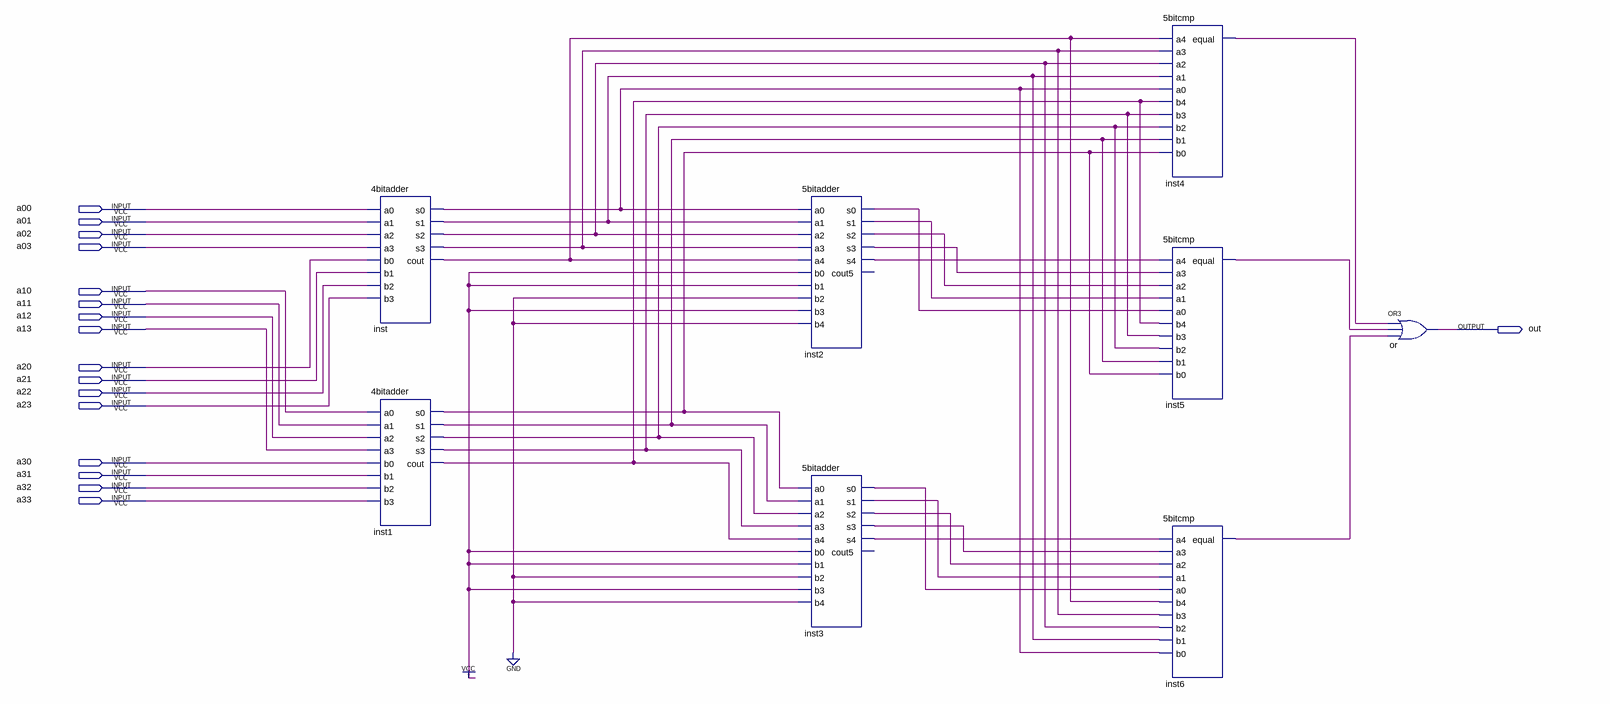
[diagram p0: schematic sheet]
// Quartus schematic multiple11.bdf as structural Verilog: 8 symbols, 17 pins
module multiple11 (
  input  a00,
  input  a01,
  input  a02,
  input  a03,
  input  a10,
  input  a11,
  input  a12,
  input  a13,
  input  a20,
  input  a21,
  input  a22,
  input  a23,
  input  a30,
  input  a31,
  input  a32,
  input  a33,
  output out
);

  wire inst1_cout, inst1_s0, inst1_s1, inst1_s2, inst1_s3, inst2_s0, inst2_s1, inst2_s2, inst2_s3, inst2_s4,
       inst3_s0, inst3_s1, inst3_s2, inst3_s3, inst3_s4, inst4_equal, inst5_equal, inst6_equal, inst_cout,
       inst_s0, inst_s1, inst_s2, inst_s3;

  \4bitadder  inst (
    .a0(a00), .a1(a01), .a2(a02), .a3(a03), .b0(a20), .b1(a21), .b2(a22), .b3(a23), .s0(inst_s0),
    .s1(inst_s1), .s2(inst_s2), .s3(inst_s3), .cout(inst_cout));
  \4bitadder  inst1 (
    .a0(a10), .a1(a11), .a2(a12), .a3(a13), .b0(a30), .b1(a31), .b2(a32), .b3(a33), .s0(inst1_s0),
    .s1(inst1_s1), .s2(inst1_s2), .s3(inst1_s3), .cout(inst1_cout));
  \5bitadder  inst2 (
    .a0(inst_s0), .a1(inst_s1), .a2(inst_s2), .a3(inst_s3), .a4(inst_cout), .b0(1'b1), .b1(1'b1), .b2(1'b0),
    .b3(1'b1), .b4(1'b0), .s0(inst2_s0), .s1(inst2_s1), .s2(inst2_s2), .s3(inst2_s3), .s4(inst2_s4));  // open: cout5
  \5bitadder  inst3 (
    .a0(inst1_s0), .a1(inst1_s1), .a2(inst1_s2), .a3(inst1_s3), .a4(inst1_cout), .b0(1'b1), .b1(1'b1),
    .b2(1'b0), .b3(1'b1), .b4(1'b0), .s0(inst3_s0), .s1(inst3_s1), .s2(inst3_s2), .s3(inst3_s3), .s4(inst3_s4));  // open: cout5
  \5bitcmp  inst4 (
    .a4(inst_cout), .a3(inst_s3), .a2(inst_s2), .a1(inst_s1), .a0(inst_s0), .b4(inst1_cout), .b3(inst1_s3),
    .b2(inst1_s2), .b1(inst1_s1), .b0(inst1_s0), .equal(inst4_equal));
  \5bitcmp  inst5 (
    .a4(inst2_s4), .a3(inst2_s3), .a2(inst2_s2), .a1(inst2_s1), .a0(inst2_s0), .b4(inst1_cout),
    .b3(inst1_s3), .b2(inst1_s2), .b1(inst1_s1), .b0(inst1_s0), .equal(inst5_equal));
  \5bitcmp  inst6 (
    .a4(inst3_s4), .a3(inst3_s3), .a2(inst3_s2), .a1(inst3_s1), .a0(inst3_s0), .b4(inst_cout), .b3(inst_s3),
    .b2(inst_s2), .b1(inst_s1), .b0(inst_s0), .equal(inst6_equal));
  or \or  (out, inst4_equal, inst5_equal, inst6_equal);
endmodule
